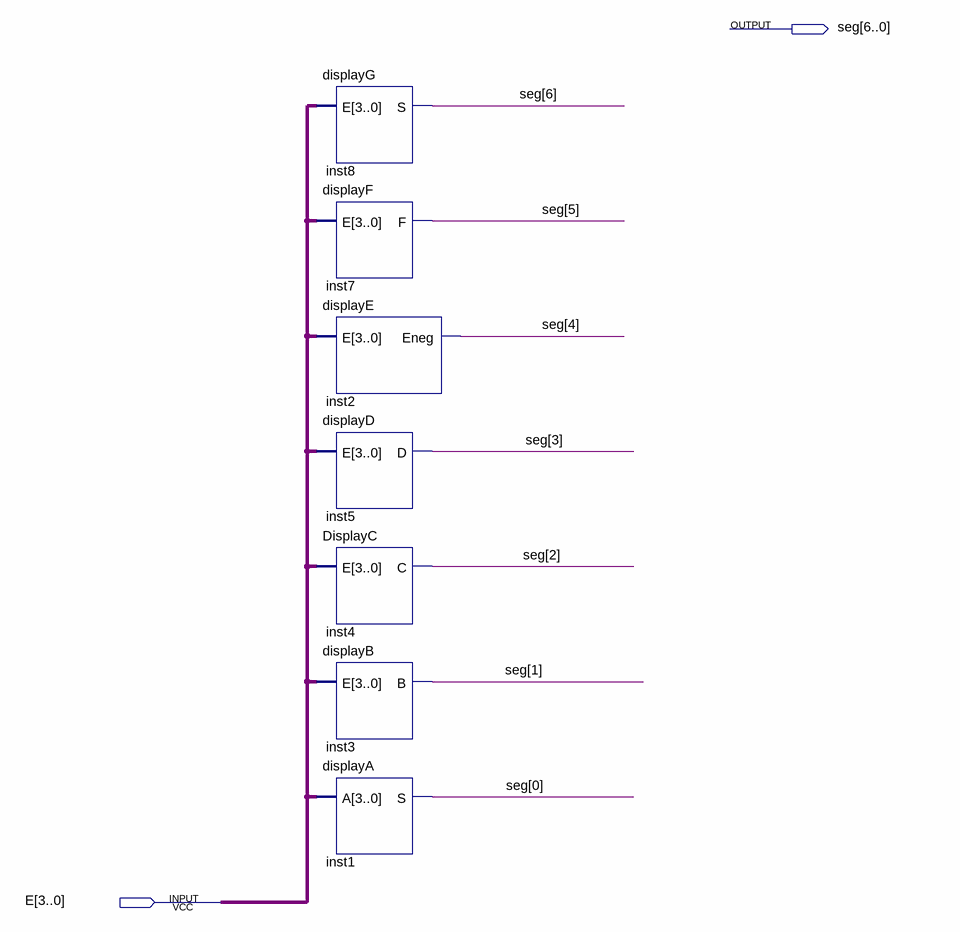
[diagram p0: schematic sheet]
// Quartus schematic display4b.bdf as structural Verilog: 7 symbols, 2 pins
module display4b (
  input  [3:0] E,
  output [6:0] seg
);

  displayG inst8 (.E(E), .S(seg[6]));
  displayF inst7 (.E(E), .F(seg[5]));
  displayE inst2 (.E(E), .Eneg(seg[4]));
  displayD inst5 (.E(E), .D(seg[3]));
  DisplayC inst4 (.E(E), .C(seg[2]));
  displayB inst3 (.E(E), .B(seg[1]));
  displayA inst1 (.A(E), .S(seg[0]));
endmodule
